# Altium schematic sheet Filtre_PWM1kHz.SchDoc: Differential Signal Generator - 1 kHz PWM Filter
size A4; Author: Philippe Groulx-Létourneau; DrawnBy: Philippe Groulx-Létourneau; SheetNumber: 3; SheetTotal: 4; SPICEModelCacheBKCTZZTD: <root> / <DocumentId>BKCTZZTD</DocumentId> / </root>
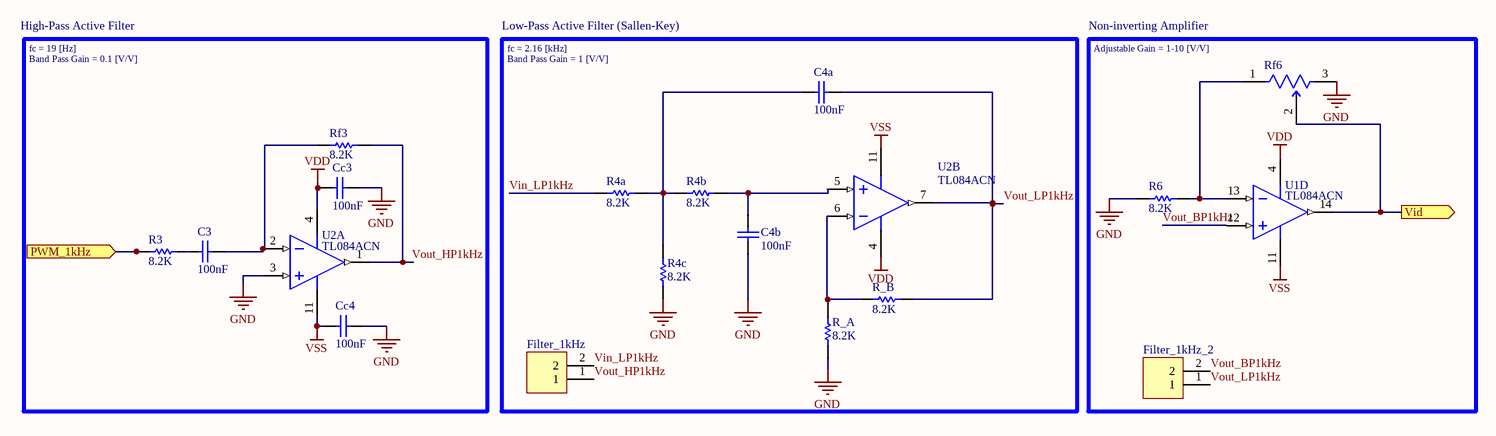
[diagram p0: Filtre_PWM1kHz.SchDoc]

## Parts
C3  value 100nF  [condensateur 0.1uf 100mil]  (hidden comment: Cap)
C4a  value 100nF  [condensateur 0.1uf 100mil]  (hidden comment: Cap)
C4b  value 100nF  [condensateur 0.1uf 100mil]  (hidden comment: Cap)
Cc3  value 100nF  [condensateur 0.1uf 100mil]  (hidden comment: Cap)
Cc4  value 100nF  [condensateur 0.1uf 100mil]  (hidden comment: Cap)
Filter_1kHz  Jumper  [Header 2P 100mil]  (value not drawn)
Filter_1kHz_2  Jumper  [Header 2P 100mil]  (value not drawn)
R3  value 8.2K  [Resistor_Axial 0.4]  (hidden comment: Res1)
R4a  value 8.2K  [Resistor_Axial 0.4]  (hidden comment: Res1)
R4b  value 8.2K  [Resistor_Axial 0.4]  (hidden comment: Res1)
R4c  value 8.2K  [Resistor_Axial 0.4]  (hidden comment: Res1)
R6  value 8.2K  [Resistor_Axial 0.4]  (hidden comment: Res1)
R_A  value 8.2K  [Resistor_Axial 0.4]  (hidden comment: Res1)
R_B  value 8.2K  [Resistor_Axial 0.4]  (hidden comment: Res1)
Rf3  value 8.2K  [Resistor_Axial 0.4]  (hidden comment: Res1)
Rf6  67WR100KLF  [FP-67W-MFG]  (value not drawn)
U1  TL084ACN  [N0014A]  (part D of 4)
U2  TL084ACN  [N0014A]  (parts A,B of 4)

## Blocks framed on the sheet
Low-Pass Active Filter (Sallen-Key): C4a C4b Filter_1kHz R4a R4b R4c R_A R_B U2
Non-inverting Amplifier: Filter_1kHz_2 R6 Rf6 U1

## Ports
PWM_1kHz (in, see Generator_main[1B]), Vid (out, see Differential_Noise_Generator[2B])

## Nets
GND: C4b.1 Cc3.2 Cc4.2 R4c.1 R6.1 R_A.1 Rf6.3 U2.3(IN1+)
VDD: Cc3.1 U1.4(VCC+) U2.4(VCC+)
VSS: Cc4.1 U1.11(VCC-) U2.11(VCC-)
PWM_1kHz: R3.1 ; port PWM_1kHz
Vid: Rf6.2 U1.14(OUT4) ; port Vid
Vin_LP1kHz: Filter_1kHz.2 R4a.1
Vout_BP1kHz: Filter_1kHz_2.2 U1.12(IN4+)
Vout_HP1kHz: Filter_1kHz.1 Rf3.2 U2.1(OUT1)
Vout_LP1kHz: C4a.1 Filter_1kHz_2.1 R_B.2 U2.7(OUT2)
NetC3_1: C3.1 R3.2
NetC3_2: C3.2 Rf3.1 U2.2(IN1-)
NetC4a_2: C4a.2 R4a.2 R4b.1 R4c.2
NetC4b_2: C4b.2 R4b.2 U2.5(IN2+)
NetR6_2: R6.2 Rf6.1 U1.13(IN4-)
NetR_A_2: R_A.2 R_B.1 U2.6(IN2-)

## Notes on the sheet
- High-Pass Active Filter
- fc = 19 [Hz]
- Band Pass Gain = 0.1 [V/V]
- fc = 2.16 [kHz]
- Band Pass Gain = 1 [V/V]
- (near Rf6) Adjustable Gain = 1-10 [V/V]

## Library data of the parts
C3 C4a C4b Cc3 Cc4 = Cap: Capacitor; Published: 8-Jun-2000; LatestRevisionDate: 17-Jul-2002; LatestRevisionNote: Re-released for DXP Platform.; PackageReference: RAD-0.3; Publisher: Altium Limited; PackageDescription: Radial Cap, Thru-Hole; 2 Leads; 0.3 in Pin Spacing
Filter_1kHz Filter_1kHz_2 = header 2 pin_UL: CONN HEADER VERT 3POS 2.54MM; LatestRevisionDate: 17-Jul-2002; LatestRevisionNote: Re-released for DXP Platform.; Publisher: Altium Limited; Digikey: 732-5315-ND
R3 R4a R4b R4c R6 R_A R_B Rf3 = Res1: Resistor; Published: 8-Jun-2000; LatestRevisionDate: 17-Jul-2002; LatestRevisionNote: Re-released for DXP Platform.; PackageReference: AXIAL-0.3; Publisher: Altium Limited; PackageDescription: Axial Device, Thru-Hole; 2 Leads; 0.3 in Pin Spacing
Rf6 = CMP-50449-000002-1: TRIMMER 100K OHM 0.5W PC PIN TOP; Power Rating: 500mW; Temperature Coefficient: 100ppm/°C; Number of Turns: 20; Voltage Rating: 200V; Resistance: 100kR; Tolerance: 10%; Radiation Hardening: No; Min Operating Temperature: -55°C; Packaging: Bulk; Depth: 4.95mm; Resistor Type: Cermet; Mount: Through Hole; Max Power Dissipation: 500mW; Package Quantity: 100; Length: 9.53mm; REACH SVHC: No SVHC; Voltage Rating (DC): 200V; Series: 67; Height: 0.409inch; Type: Potentiometer; Weight: 1.1g; RoHS Compliant: Yes; Technology: CERMET; Lead Free: Lead Free; Termination: Pin; Resistance Tolerance: 10%; Max Operating Temperature: 125°C; Military Standard: Not
U1 U2 = CMP-0017-00814-2: JFET-Input Operational Amplifier, 7 to 36 V, 0 to 70 degC, 14-pin DIP (N14), Pb-Free (RoHS); Manufacturer: Texas Instruments; Sub Family: General Purpose Amplifier, High Supply Voltage Amplifier (>=30V); Slew Rate(Typ)(V/us): 13; Offset Drift(Typ)(uV/C): 18; GBW(Typ)(MHz): 3; Number of Channels: 4; Rating: Catalog; Total Supply Voltage(Max)(+5V is 5, +/-5V is 10): 36; Vio (25C)(Max)(mV): 6; IIB(Max)(pA): 200; CMRR(Min)(dB): 75; Total Supply Voltage(Min)(+5V is 5, +/-5V is 10): 7; Iq per channel(Max)(mA): 2.8; PackageReference: N0014A; ComponentLink1Description: Manufacturer URL; ComponentLink1URL: http://www.ti.com/; Code_JEDEC: MS-001; PackageVersion: 4040049/E, 12/2002; Mounting Technology: Through Hole; PackageDescription: 14-Pin Plastic In-Line, Body 19.305 x 6.35 mm, Pitch 2.54 mm; ComponentLink2URL: http://www.ti.com/lit/ds/symlink/tl084a.pdf; Vn at 1kHz(Typ)(nV/rtHz): 18; DatasheetVersion: SLOS081G; ComponentLink3Description: Package Specification; ComponentLink3URL: http://www.ti.com/lit/ml/mpdi002c/mpdi002c.pdf; PartNumber: TL084ACN; Eco-Plan: Pb-Free (RoHS); ComponentLink2Description: Datasheet